# EAGLE design hw2 (EAGLE 7.5.0)
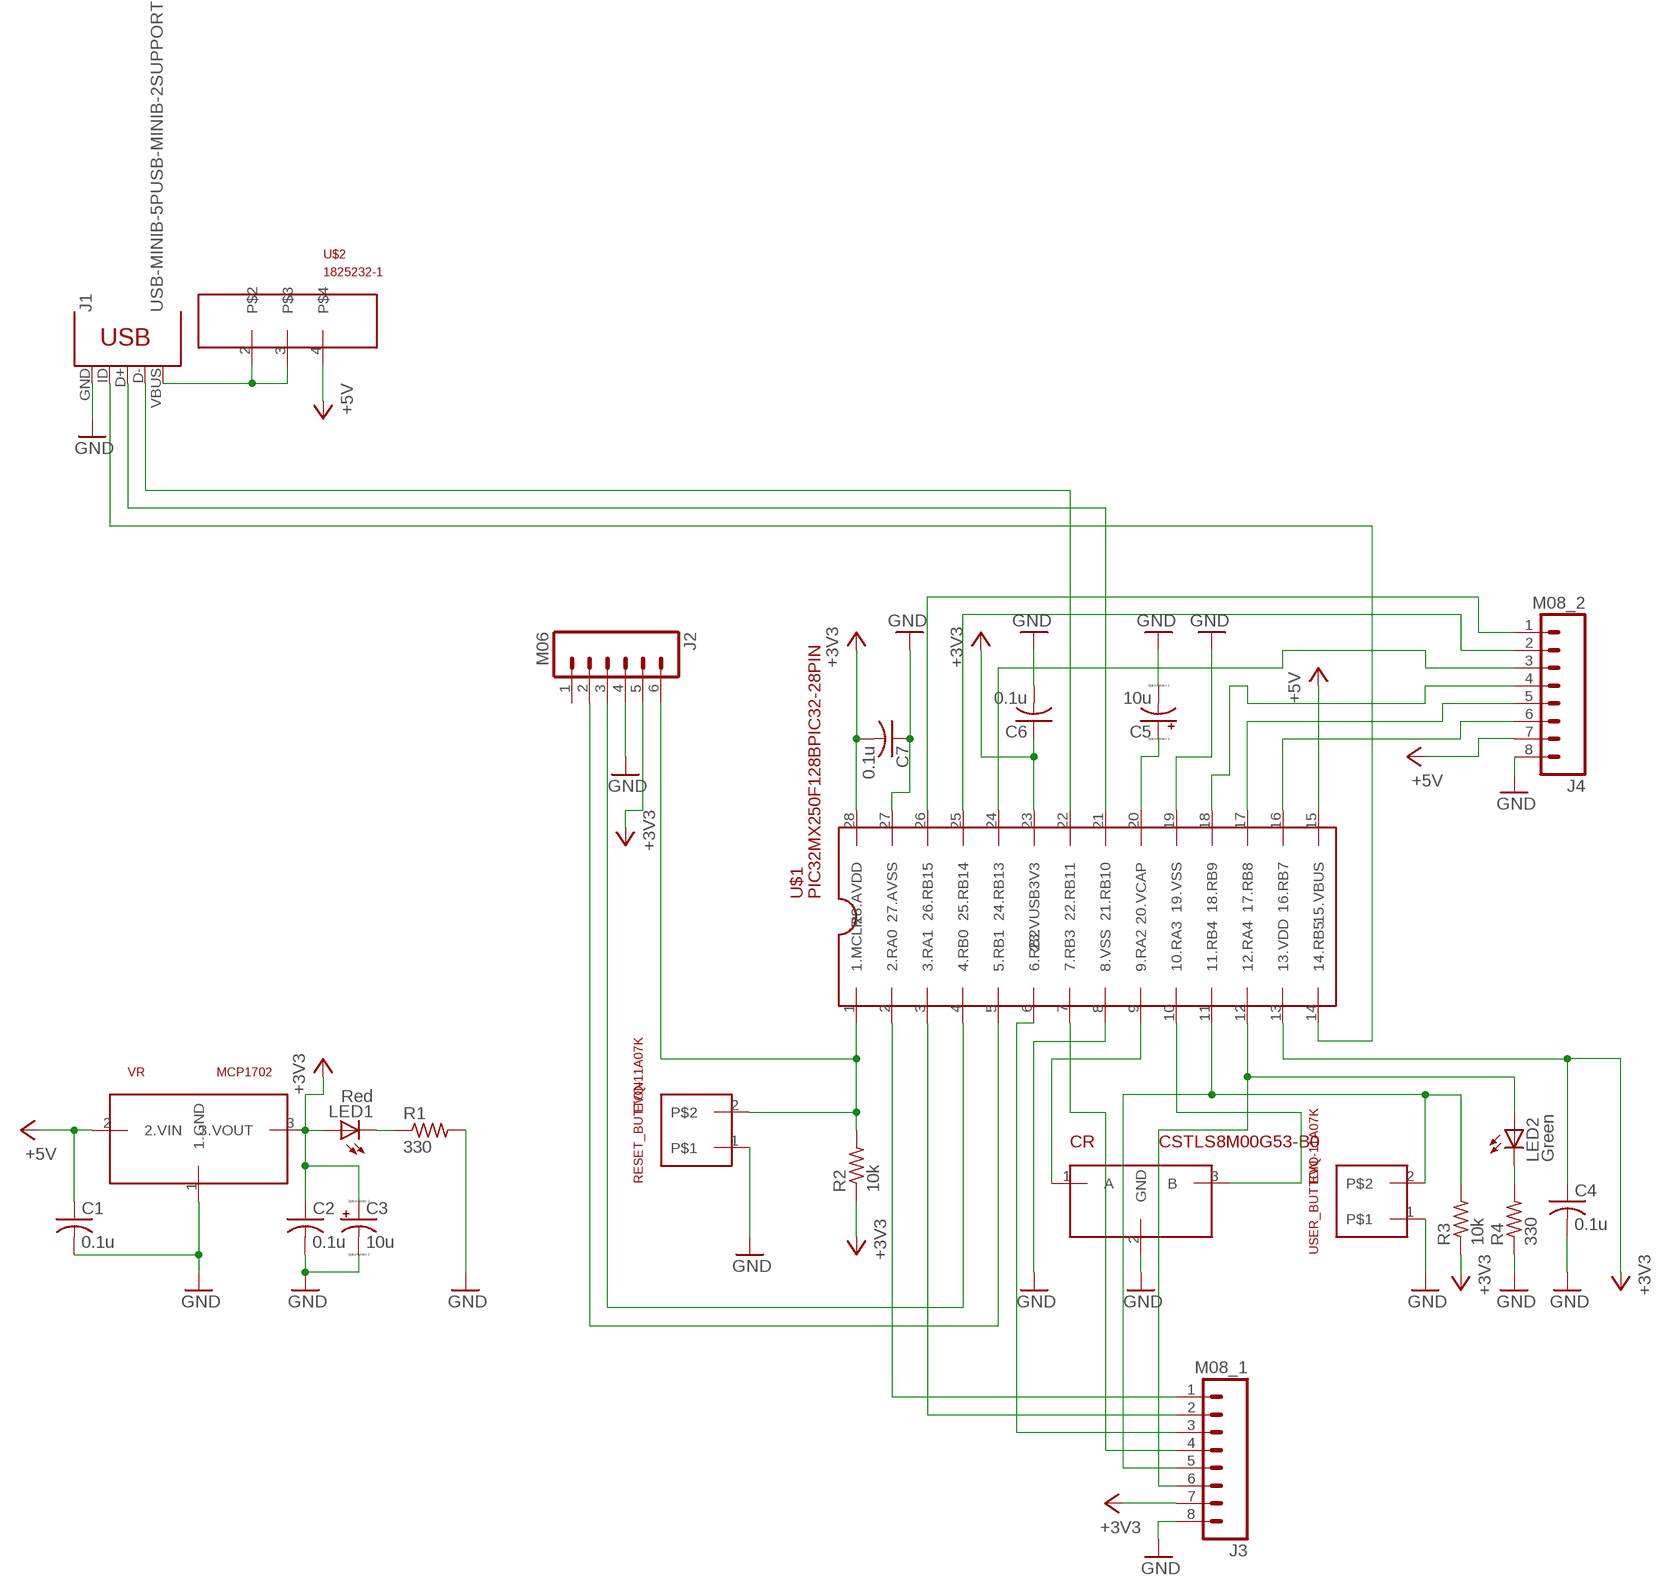
[diagram p0: schematic, sheet 1]

## Parts
C1  0.1u  C-US025-025X050  [C025-025X050]
C2  0.1u  C-US025-025X050  [C025-025X050]
C3  10u  CPOL-USB45181A  [B45181A]
C4  0.1u  C-US025-025X050  [C025-025X050]
C5  10u  CPOL-USB45181A  [B45181A]
C6  0.1u  C-US025-025X050  [C025-025X050]
C7  0.1u  C-US025-025X050  [C025-025X050]
CR  CSTLS8M00G53-B0  [1X03_NO_SILK]
J1  USB-MINIB-5PUSB-MINIB-2SUPPORT  [USB-MB-H]
J2  M06  M06SILK_FEMALE_PTH  [1X06]
J3  M08_1  M08  [1X08_ROUND]
J4  M08_2  M08  [1X08_ROUND]
LED1  Red  LED3MM  [LED3MM]
LED2  Green  LED3MM  [LED3MM]
R1  330  R-US_0207/10  [0207/10]
R2  10k  R-US_0207/10  [0207/10]
R3  10k  R-US_0207/10  [0207/10]
R4  330  R-US_0207/10  [0207/10]
RESET_BUTTON  EVQ-11A07K  [1X02_NO_SILK_FAR_BOUNDED]
U$1  PIC32MX250F128BPIC32-28PIN  [DIL28-3]
U$2  1825232-1  [1X05]
USER_BUTTON  EVQ-11A07K  [1X02_NO_SILK_FAR_BOUNDED]
VR  MCP1702  [TO92]

## Nets
+3V3: C2.1 C3.+ C4.1 C6.1 C7.2 J2.5 J3.7 LED1.A R2.1 R3.1 U$1.13(13.VDD) U$1.23(23.VUSB3V3) U$1.28(28.AVDD) VR.3(3.VOUT)
+5V: C1.1 J4.7 U$1.15(15.VBUS) U$2.4 VR.2(2.VIN)
GND: C1.2 C2.2 C3.- C4.2 C5.- C6.2 C7.1 CR.2(GND) J1.GND J2.4 J3.8 J4.8 R1.2 R4.1 RESET_BUTTON.1 U$1.8(8.VSS) U$1.19(19.VSS) U$1.27(27.AVSS) USER_BUTTON.1 VR.1(1.GND)
N$1: J1.ID U$1.14(14.RB5)
N$2: J1.D+ U$1.21(21.RB10)
N$3: LED1.K(C) R1.1
N$4: J1.VBUS U$2.2 U$2.3
N$5: J1.D- U$1.22(22.RB11)
N$6: J2.2 U$1.5(5.RB1)
N$7: J2.6 R2.2 RESET_BUTTON.2 U$1.1(1.MCLR)
N$8: J2.3 U$1.4(4.RB0)
N$9: CR.1(A) U$1.9(9.RA2)
N$10: J3.5 R3.2 U$1.11(11.RB4) USER_BUTTON.2
N$11: CR.3(B) U$1.10(10.RA3)
N$12: J3.6 LED2.A U$1.12(12.RA4)
N$13: LED2.K(C) R4.2
N$14: C5.+ U$1.20(20.VCAP)
N$15: J3.1 U$1.2(2.RA0)
N$16: J3.2 U$1.3(3.RA1)
N$17: J3.3 U$1.6(6.RB2)
N$18: J3.4 U$1.7(7.RB3)
N$19: J4.1 U$1.26(26.RB15)
N$20: J4.2 U$1.25(25.RB14)
N$21: J4.3 U$1.24(24.RB13)
N$22: J4.4 U$1.18(18.RB9)
N$23: J4.5 U$1.17(17.RB8)
N$24: J4.6 U$1.16(16.RB7)
Unconnected: J2.1

## Library data of the parts
C1 C2 C4 C6 C7 = hw2:C-US: CAPACITOR, American symbol
C3 C5 = hw2:CPOL-US: POLARIZED CAPACITOR, American symbol
CR = hw2:CSTLS8M00G53-B0: Crystal resonator. Middle pin is ground.
J1 = hw2:USB-MINIB-5P: Mini-USB "B" connector with 5th pin broken out. Created new symbol breaking out 5th "ID" pin in mini/micro USB connector spec. See: http://en.wikipedia.org/wiki/Mini_usb#Cables. Uses same footprint as 4-pin symbol. Also added pins to connect to mounting / shield pads if required (probably not generally needed as signals aren't shielded once they leave the connector).
J2 = hw2:M06: Header 6 Standard 6-pin 0.1" header. Use with straight break away headers (SKU : PRT-00116), right angle break away headers (PRT-00553), swiss pins (PRT-00743), machine pins (PRT-00117), and female headers (PRT-00115). Molex polarized connector foot print use with SKU : PRT-08094 with associated crimp pins and housings. NOTES ON THE VARIANTS LOCK and LOCK_LONGPADS... This footprint was designed to help hold the alignment of a through-hole component (i.e. 6-pin header) while soldering it into place. You may notice that each hole has been shifted either up or down by 0.005 of an inch from it's more standard position (which is a perfectly straight line). This slight alteration caused the pins (the squares in the middle) to touch the edges of the holes. Because they are alternating, it causes a "brace" to hold the component in place. 0.005 has proven to be the perfect amount of "off-center" position when using our standard breakaway headers. Although looks a little odd when you look at the bare footprint, once you have a header in there, the alteration is very hard to notice. Also,if you push a header all the way into place, it is covered up entirely on the bottom side. This idea of altering the position of holes to aid alignment will be further integrated into the Sparkfun Library for other footprints. It can help hold any component with 3 or more connection pins.; PROD_ID: CONN-08437
J3 J4 = hw2:M08: Header 8 Standard 8-pin 0.1" header. Use with straight break away headers (SKU : PRT-00116), right angle break away headers (PRT-00553), swiss pins (PRT-00743), machine pins (PRT-00117), and female headers (PRT-00115).; PROD_ID: CONN-08437
LED1 LED2 = hw2:LED: LED OSRAM: - CHIPLED LG R971, LG N971, LY N971, LG Q971, LY Q971, LO R971, LY R971 LH N974, LH R974 LS Q976, LO Q976, LY Q976 LO Q996 - Hyper CHIPLED LW Q18S LB Q993, LB Q99A, LB R99A - SideLED LS A670, LO A670, LY A670, LG A670, LP A670 LB A673, LV A673, LT A673, LW A673 LH A674 LY A675 LS A676, LA A676, LO A676, LY A676, LW A676 LS A679, LY A679, LG A679 - Hyper Micro SIDELED® LS Y876, LA Y876, LO Y876, LY Y876 LT Y87S - SmartLED LW L88C, LW L88S LB L89C, LB L89S, LG L890 LS L89K, LO L89K, LY L89K LS L896, LA L896, LO L896, LY L896 - TOPLED LS T670, LO T670, LY T670, LG T670, LP T670 LSG T670, LSP T670, LSY T670, LOP T670, LYG T670 LG T671, LOG T671, LSG T671 LB T673, LV T673, LT T673, LW T673 LH T674 LS T676, LA T676, LO T676, LY T676, LB T676, LH T676, LSB T676, LW T676 LB T67C, LV T67C, LT T67C, LS T67K, LO T67K, LY T67K, LW E67C LS E67B, LA E67B, LO E67B, LY E67B, LB E67C, LV E67C, LT E67C LW T67C LS T679, LY T679, LG T679 LS T770, LO T770, LY T770, LG T770, LP T770 LB T773, LV T773, LT T773, LW T773 LH T774 LS E675, LA E675, LY E675, LS T675 LS T776, LA T776, LO T776, LY T776, LB T776 LHGB T686 LT T68C, LB T68C - Hyper Mini TOPLED® LB M676 - Mini TOPLED Santana® LG M470 LS M47K, LO M47K, LY M47K Source: http://www.osram.convergy.de LUXEON: - LUMILED® LXK2-PW12-R00, LXK2-PW12-S00, LXK2-PW14-U00, LXK2-PW14-V00 LXK2-PM12-R00, LXK2-PM12-S00, LXK2-PM14-U00 LXK2-PE12-Q00, LXK2-PE12-R00, LXK2-PE12-S00, LXK2-PE14-T00, LXK2-PE14-U00 LXK2-PB12-K00, LXK2-PB12-L00, LXK2-PB12-M00, LXK2-PB14-N00, LXK2-PB14-P00, LXK2-PB14-Q00 LXK2-PR12-L00, LXK2-PR12-M00, LXK2-PR14-Q00, LXK2-PR14-R00 LXK2-PD12-Q00, LXK2-PD12-R00, LXK2-PD12-S00 LXK2-PH12-R00, LXK2-PH12-S00 LXK2-PL12-P00, LXK2-PL12-Q00, LXK2-PL12-R00 Source: www.luxeon.com KINGBRIGHT: KA-3528ASYC Source: www.kingbright.com
R1-R4 = hw2:R-US_: RESISTOR, American symbol
RESET_BUTTON USER_BUTTON = hw2:EVQ-11A07K: Pushbutton
U$1 = hw2:PIC32MX250F128B
U$2 = hw2:1825232-1: Slide switch. Only PIN1 and PIN4 are used.
VR = hw2:MCP1702: Voltage regulator 1. GND 2. VIN 3. VOUT

## Board
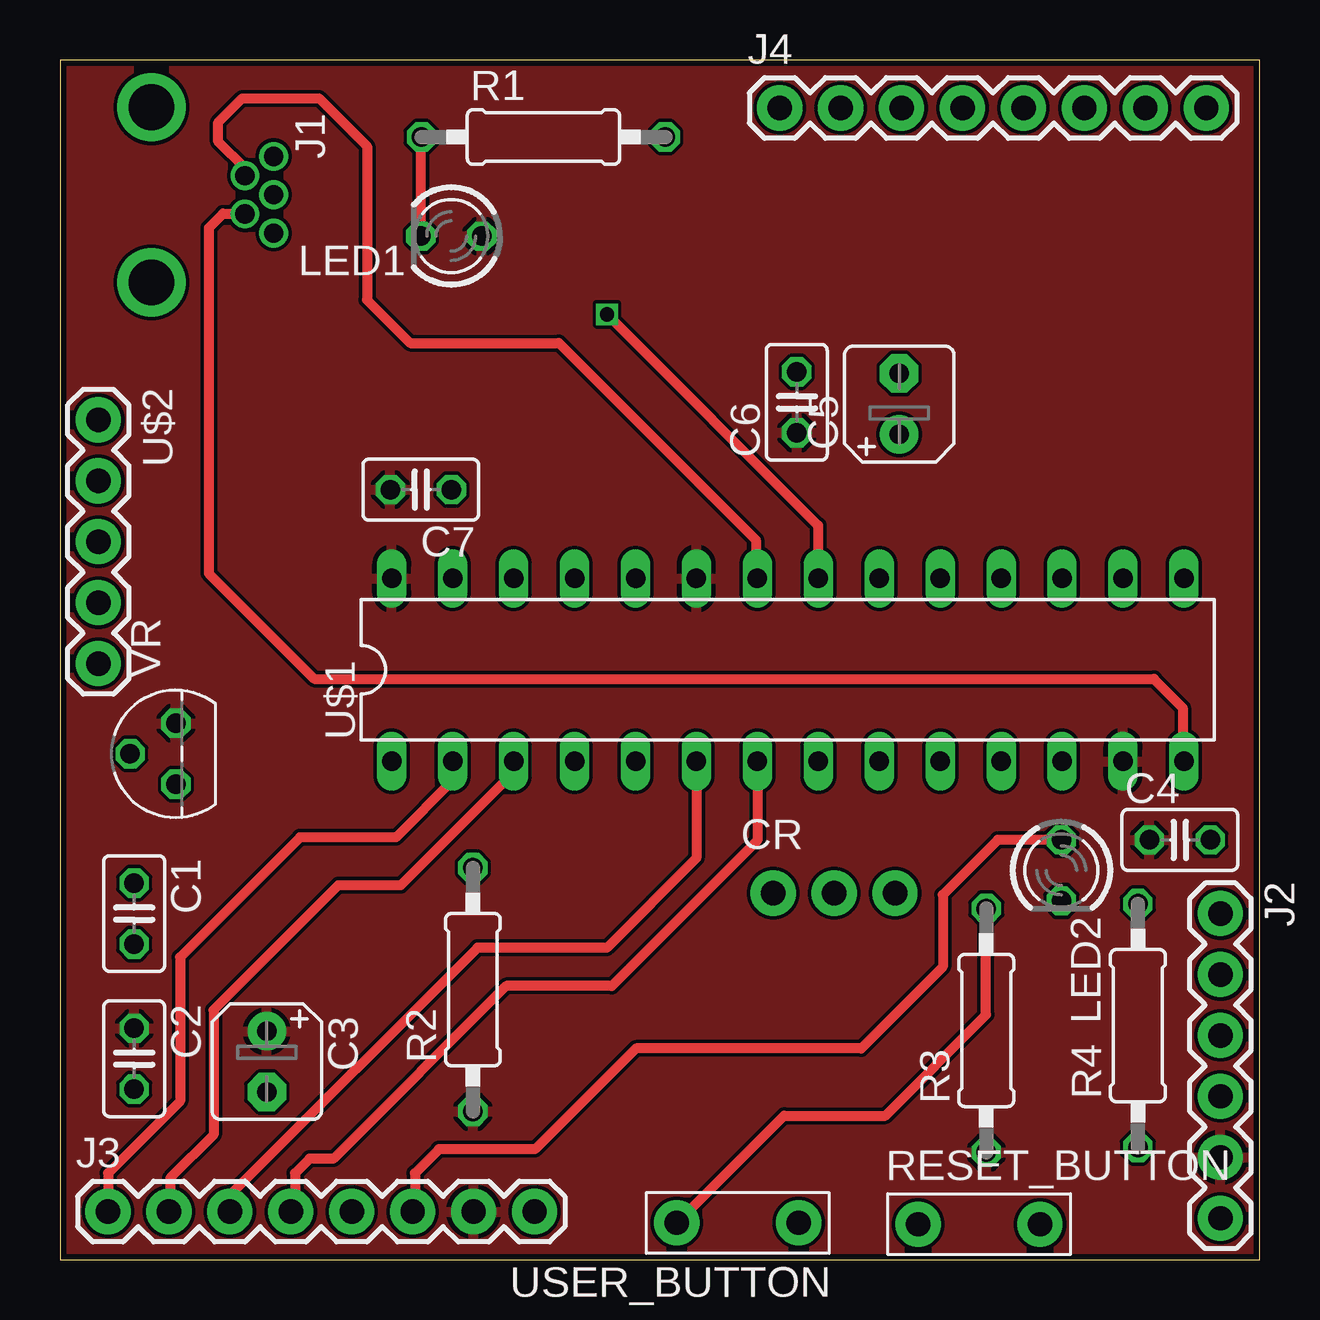
[diagram p1: board, top side]
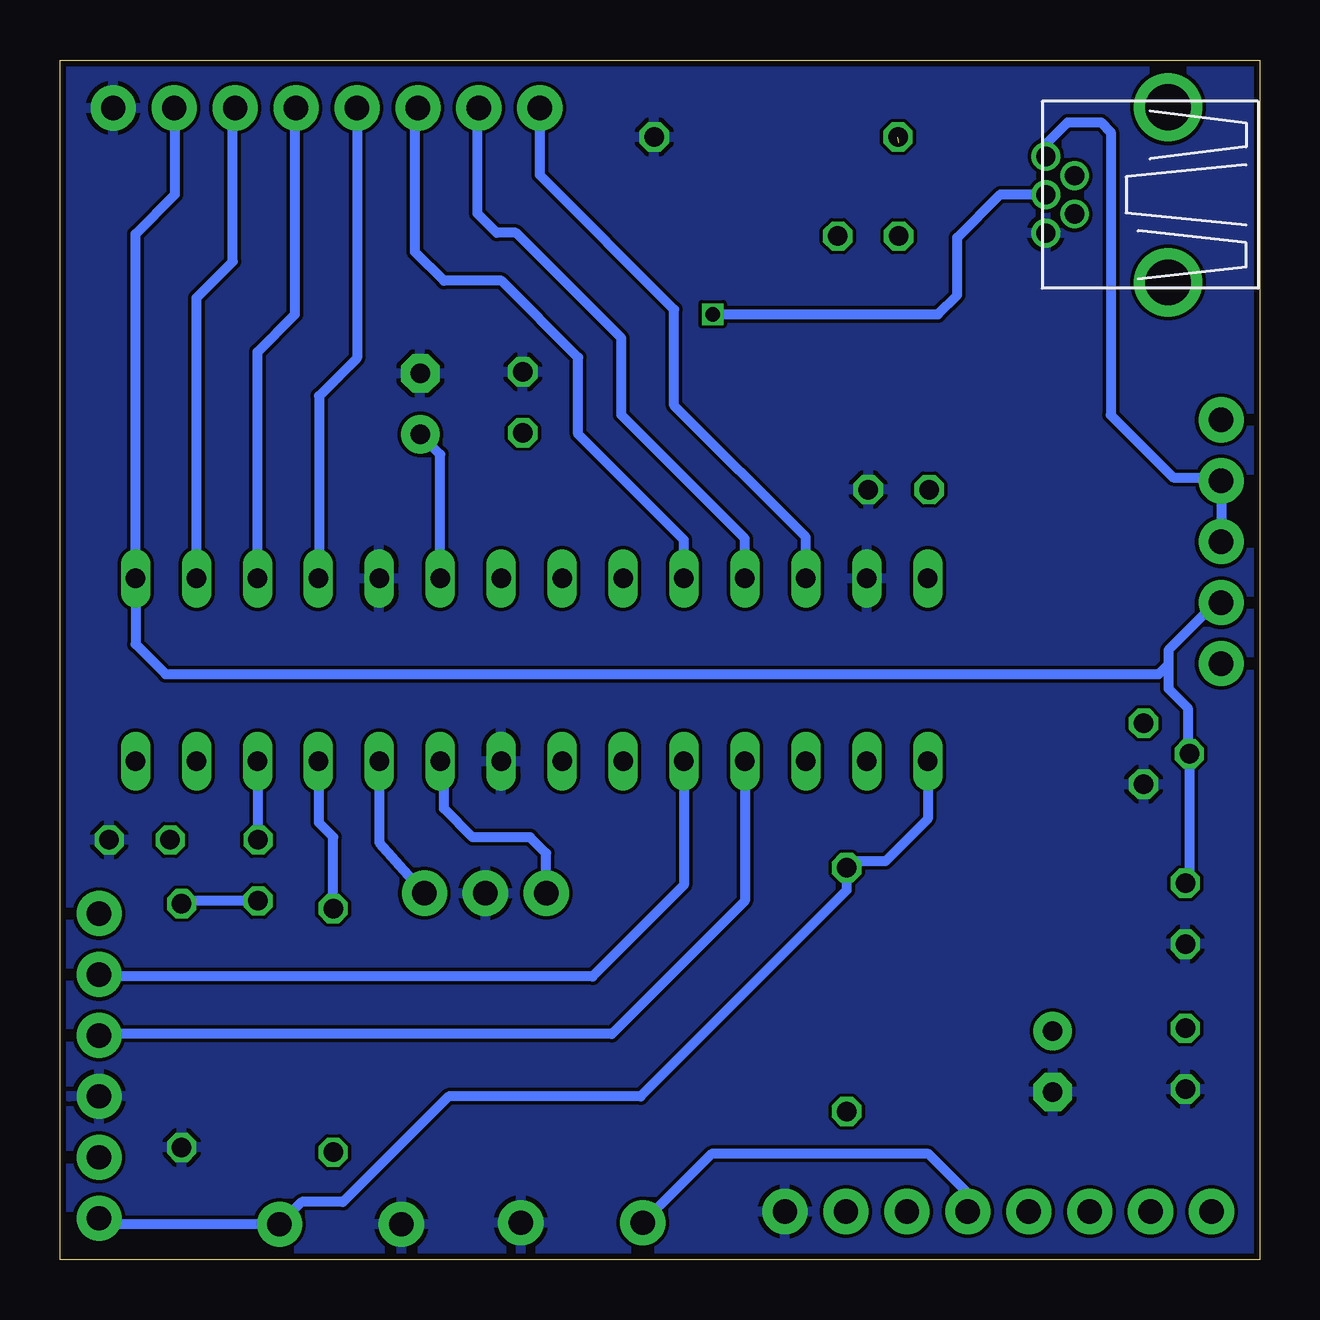
[diagram p2: board, bottom side, seen from below]

Size 50 x 50 mm. Coordinates in mm from the lower left corner, seen from the top.
Outline: 0,0 50,0 50,50 0,50 0,0
Copper layers (1*16): Top 0.018mm / dielectric 1.55mm / Bottom 0.018mm
Design rules "eC_2Layer_PClass6_BaseCopperO18_eCDefault": minimum track width 0.15mm, minimum drill 0.35mm, track to track 0.15mm, track to pad 0.15mm, pad to pad 0.15mm, via to via 0.15mm, smd to smd 0mil, copper to edge 0.25mm, drill to drill 0.35mm, minimum pad ring 0.175mm, minimum via ring 0.125mm, stop-mask expansion 0mil, vias tented up to drill 0.45mm, thermal gap 0.2mm

### Footprints (pad centres in the part's own frame; a part is rotated, then mirrored left to right if it is on the bottom)
C025-025X050 = drill 0.813 octagon: 1 -1.27,0; 2 1.27,0
B45181A = drill 0.813 pad 1.6: + -1.27,0 | drill 0.813 pad 1.6 octagon: - 1.27,0
1X03_NO_SILK = drill 1.016 pad 1.88: 1 0,0; 2 2.54,0; 3 5.08,0
USB-MB-H = drill 0.8: D+ 5.1,0; D- 3.9,0.8; GND 5.1,-1.6; ID 3.9,-0.8; VBUS 5.1,1.6 | drill 1.9: P$6 0,-3.65; P$7 0,3.65
1X06 = drill 1.016 pad 1.88: 1 0,0; 2 2.54,0; 3 5.08,0; 4 7.62,0; 5 10.16,0; 6 12.7,0
1X08_ROUND = drill 1.016 pad 1.88: 1 0,0; 2 2.54,0; 3 5.08,0; 4 7.62,0; 5 10.16,0; 6 12.7,0; 7 15.24,0; 8 17.78,0
LED3MM = drill 0.813 octagon: A -1.27,0; K 1.27,0
0207/10 = drill 0.813 octagon: 1 -5.08,0; 2 5.08,0
1X02_NO_SILK_FAR_BOUNDED = drill 1.016 pad 1.88: 1 0,0; 2 5.08,0
DIL28-3 = drill 0.813 long: 1 -16.51,-3.81; 2 -13.97,-3.81; 3 -11.43,-3.81; 4 -8.89,-3.81; 5 -6.35,-3.81; 6 -3.81,-3.81; 7 -1.27,-3.81; 8 1.27,-3.81; 9 3.81,-3.81; 10 6.35,-3.81; 11 8.89,-3.81; 12 11.43,-3.81; 13 13.97,-3.81; 14 16.51,-3.81; 15 16.51,3.81; 16 13.97,3.81; 17 11.43,3.81; 18 8.89,3.81; 19 6.35,3.81; 20 3.81,3.81; 21 1.27,3.81; 22 -1.27,3.81; 23 -3.81,3.81; 24 -6.35,3.81; 25 -8.89,3.81; 26 -11.43,3.81; 27 -13.97,3.81; 28 -16.51,3.81
1X05 = drill 1.016 pad 1.88: 1 0,0; 2 2.54,0; 3 5.08,0; 4 7.62,0; 5 10.16,0
TO92 = drill 0.813 octagon: 1 -1.27,0; 2 0,1.905; 3 1.27,0

### Placement (x,y rotation side)
C1  3.09,14.42 270 top
C2  3.09,8.37 270 top
C3  8.62,8.25 270 top
C4  46.68,17.49 0 top
C5  34.98,35.66 90 top
C6  30.71,35.73 90 top
C7  15.04,32.09 180 top
CR  29.73,15.27 0 top
J1  3.81,44.38 0 top
J2  48.37,14.42 270 top
J3  2,2 0 top
J4  30,48 0 top
LED1  16.31,42.66 180 top
LED2  41.74,16.22 270 top
R1  20.15,46.79 0 top
R2  17.21,11.25 90 top
R3  38.61,9.55 90 top
R4  44.93,9.75 90 top
RESET_BUTTON  35.77,1.47 0 top
U$1  30.34,24.58 0 top
U$2  1.6,35 270 top
USER_BUTTON  30.79,1.53 180 top
VR  4.83,21.08 90 top

### Tracks (layer width: path | path; a pad name or v marks a point on that pad's centre or on a via)
+3V3
  pour Top: 0,50 50,50 50,0 0,0
+5V
  Bottom 0.406: U$2.4 1.82,27.38 3.8,25.4 3.8,24.8 | 3.8,24.8 3.8,23.8 3,23 3,21.16 VR.2 2.92,15.86 C1.1 | 3.8,24.8 4.2,24.4 45.6,24.4 46.85,25.65 U$1.15 46.85,42.75 45.2,44.4 45.2,47.96 J4.7
GND
  pour Bottom: 0,50 50,50 50,0 0,0
N$1
  Top 0.406: U$1.14 46.8,20.82 46.8,23 45.6,24.2 10.6,24.2 6.2,28.6 6.2,43 6.8,43.6 7.69,43.6 J1.ID
N$2  (via drill 0.6)
  Top 0.406: v22.8,39.4 31.6,30.6 U$1.21
  Bottom 0.406: v22.8,39.4 13.4,39.4 12.6,40.2 12.6,42.6 10.8,44.4 8.93,44.4 J1.D+
N$3  (1 unrouted)
  Top 0.406: 15.04,46.56 LED1.K
N$4
  Bottom 0.406: U$2.3 U$2.2 1.74,32.6 3.6,32.6 6.2,35.2 6.2,47 6.6,47.4 8,47.4 8.91,46.49 J1.VBUS
N$5
  Top 0.406: U$1.22 29,28.46 29,30 20.8,38.2 14.6,38.2 12.8,40 12.8,46.4 10.8,48.4 7.6,48.4 6.6,47.4 6.6,46.6 7.71,45.49 J1.D-
N$6
  Bottom 0.406: U$1.5 23.99,15.61 27.8,11.8 48.29,11.8 J2.2
N$7
  Bottom 0.406: J2.6 48.12,1.47 RESET_BUTTON.2 39.92,2.4 38.2,2.4 33.8,6.8 25.8,6.8 17.21,15.39 R2.2 16.94,16.6 15.6,16.6 13.83,18.37 U$1.1
N$8
  Bottom 0.406: U$1.4 21.45,14.95 27,9.4 48.31,9.4 J2.3
N$9
  Bottom 0.406: CR.1 29.73,16.93 30.4,17.6 32.8,17.6 34,18.8 34,20.62 U$1.9
N$10
  Top 0.406: USER_BUTTON.2 30.18,6 34.4,6 38.6,10.2 R3.2
  Bottom 0.406: 12.16,1.56 J3.5 12.16,2.76 13.8,4.4 22.84,4.4 USER_BUTTON.2 | R3.2 38.61,17.61 39.2,18.2 39.2,20.74 U$1.11
N$11
  Bottom 0.406: U$1.10 36.69,17.39 CR.3
N$12
  Top 0.406: 14.8,1.9 J3.6 14.8,2.1 14.8,3.6 15.8,4.6 19.8,4.6 24,8.8 33.4,8.8 36.8,12.2 36.8,15.2 39.09,17.49 LED2.A
  Bottom 0.406: LED2.A 41.74,20.74 U$1.12
N$13
  Bottom 0.406: LED2.K 44.81,14.95 R4.2
N$14
  Bottom 0.406: U$1.20 34.15,33.56 C5.+
N$15
  Top 0.406: U$1.2 16.37,19.97 14,17.6 10,17.6 5,12.6 5,6.6 2,3.6 J3.1
N$16
  Top 0.406: U$1.3 18.91,20.31 14.2,15.6 11.6,15.6 6.4,10.4 6.4,5.2 4.6,3.4 4.6,1.46 J3.2
N$17
  Top 0.406: U$1.6 26.53,16.73 22.8,13 17.4,13 7.2,2.8 7.2,1.52 J3.3
N$18
  Top 0.406: U$1.7 29.07,17.47 23,11.4 18.6,11.4 11.4,4.2 10.4,4.2 9.8,3.6 9.8,2.18 J3.4
N$19
  Bottom 0.406: U$1.26 18.91,30.11 24.4,35.6 24.4,39.6 30,45.2 J4.1
N$20
  Bottom 0.406: U$1.25 21.45,30.05 26.6,35.2 26.6,38.4 31,42.8 31.8,42.8 32.6,43.6 32.6,47.94 J4.2
N$21
  Bottom 0.406: U$1.24 23.99,29.99 28.4,34.4 28.4,37.6 31.6,40.8 34,40.8 35.2,42 35.2,47.88 J4.3
N$22
  Bottom 0.406: J4.4 37.62,37.58 39.2,36 39.2,28.42 U$1.18
N$23
  Bottom 0.406: U$1.17 41.77,37.83 40.2,39.4 40.2,47.96 J4.5
N$24
  Bottom 0.406: U$1.16 44.31,40.09 42.8,41.6 42.8,47.9 J4.6